# EAGLE design circuit_design_2 (EAGLE 8.6.1)
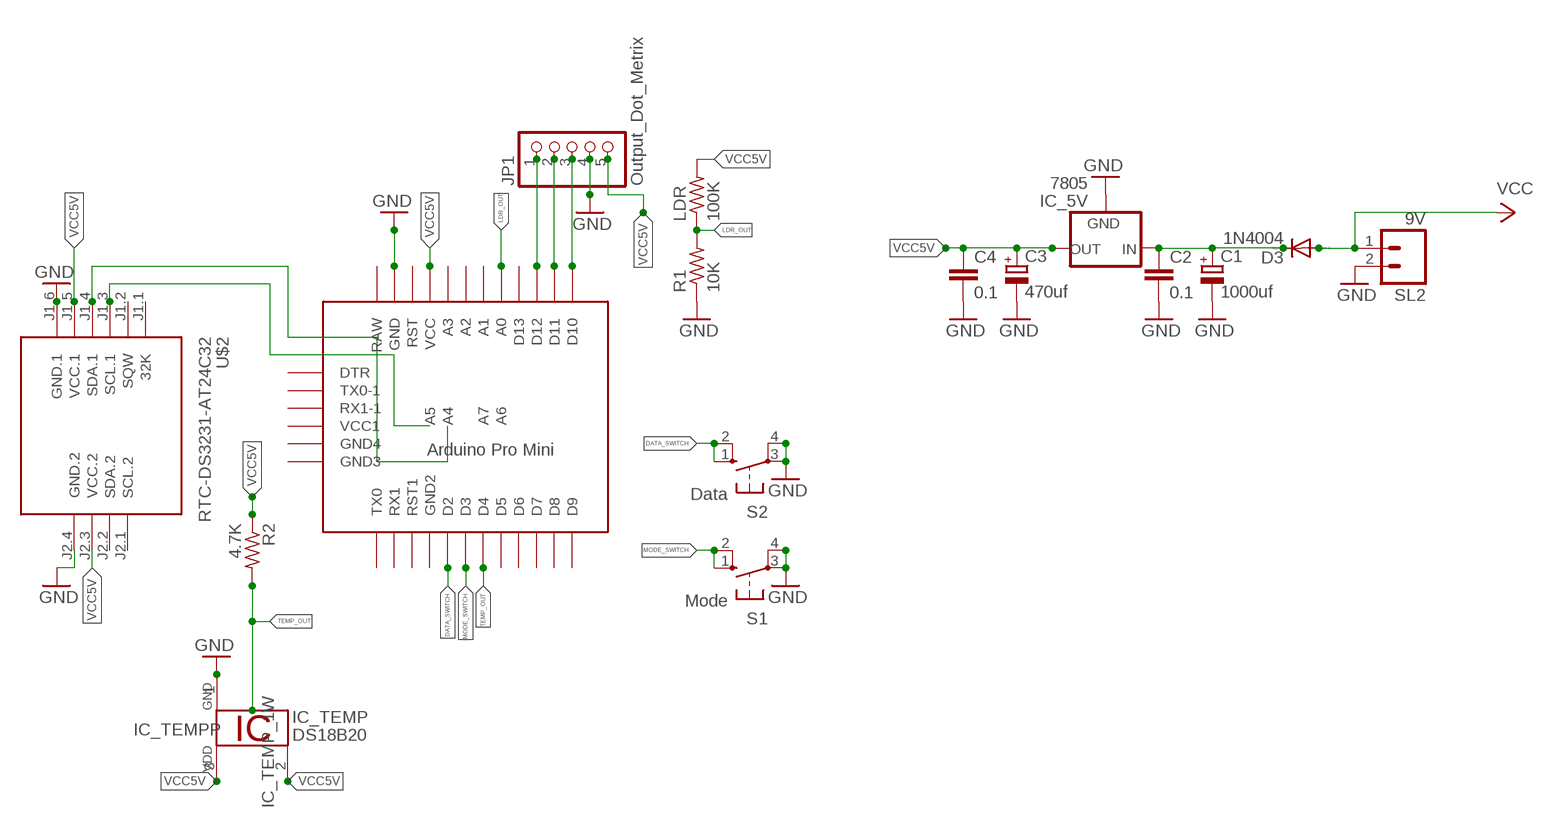
[diagram p0: schematic, sheet 1]

## Parts
C1  1000uf  CPOL-EUE2,5-6E  [E2,5-6E]
C2  0.1  C-EU025-024X044  [C025-024X044]
C3  470uf  CPOL-EUE2,5-6E  [E2,5-6E]
C4  0.1  C-EU025-024X044  [C025-024X044]
D3  1N4004  [DO41-10]
IC_5V  7805  78XXS  [78XXS]
IC_TEMP  DS18B20  [TO92-]
JP1  Output_Dot_Metrix  PINHD-1X5  [1X05]
LDR  100K  R-US_V526-0  [V526-0]
R1  10K  R-US_0309/12  [0309/12]
R2  4.7K  R-US_0309/12  [0309/12]
S1  Mode  10-XX  [B3F-10XX]
S2  Data  10-XX  [B3F-10XX]
SL2  9V  M02  [02P]
U$1  PRO-MINI-2  [PRO-MINI-2]
U$2  RTC-DS3231-AT24C32  [RTC-DS3231-AT24C32]

## Nets
DATA_SWITCH: S2.1(S) S2.2(S1) U$1.D2
GND: C1.- C2.2 C3.- C4.2 IC_5V.GND IC_TEMP.1 JP1.4 R1.1 S1.3(P) S1.4(P1) S2.3(P) S2.4(P1) SL2.2 U$1.GND U$2.J1.6(GND.1) U$2.J2.4(GND.2)
LDR_OUT: LDR.1 R1.2 U$1.A0
MODE_SWITCH: S1.1(S) S1.2(S1) U$1.D3
N$1: C1.+ C2.1 D3.C IC_5V.IN
N$2: U$2.J1.5(VCC.1)
N$3: JP1.5
N$4: U$1.VCC
N$5: IC_TEMP.2
N$6: IC_TEMP.3
N$7: R2.1
N$8: LDR.2
N$9: U$2.J1.4(SDA.1)
N$10: U$2.J1.3(SCL.1)
N$11: JP1.1 U$1.D12
N$12: JP1.2 U$1.D11
N$13: JP1.3 U$1.D10
N$14: U$2.J2.3(VCC.2)
TEMP_OUT: R2.2 U$1.D4
VCC: D3.A SL2.1
VCC5V: C3.+ C4.1 IC_5V.OUT
Unconnected: U$1.A1 U$1.A2 U$1.A3 U$1.A4 U$1.A5 U$1.A6 U$1.A7 U$1.D5 U$1.D6 U$1.D7 U$1.D8 U$1.D9 U$1.D13 U$1.DTR U$1.GND1(GND2) U$1.GND2(GND3) U$1.GND3(GND4) U$1.RAW U$1.RST U$1.RST1 U$1.RX1 U$1.RX1-1 U$1.TX0 U$1.TX0-1 U$1.VCC1 U$2.J1.1(32K) U$2.J1.2(SQW) U$2.J2.1(SCL.2) U$2.J2.2(SDA.2)

## Library data of the parts
C1 C3 = rcl:CPOL-EU: POLARIZED CAPACITOR, European symbol
C2 C4 = rcl:C-EU: CAPACITOR, European symbol
D3 = diode:1N4004: DIODE general purpose rectifier, 1 A
IC_5V = v-reg:78XXS: VOLTAGE REGULATOR
IC_TEMP = 1wire:DS18B20: Programmable Resolution Digital Thermometer This chip provides a onewire thermosensor with approx. 0.5°C accuracy. A programmable over/undertemperure alarm is available. The precision can be set from 9..12 bits. Notes: Vdd must be applied for accurate measurements at low temperatures, as the parasite power circuit otherwise heats the sensor. If parasite power is used, Vdd has to be connected to GND. The DS1822 is a low-cost thermometer chip, the DS18S20 is similar to the DS18B20, but with 9 Bit precision only. Author: Jan Kandziora <jjj@gmx.de>
JP1 = pinhead:PINHD-1X5: PIN HEADER
LDR = rcl:R-US_: RESISTOR, American symbol; SPICEPREFIX: R
R1 R2 = rcl:R-US_: RESISTOR, American symbol
S1 S2 = switch-omron:10-XX: OMRON SWITCH; MPN: B3F-1000; OC_FARNELL: 176432; OC_NEWARK: 36M3542
SL2 = con-amp-quick:M02: AMP QUICK CONNECTOR; OC_FARNELL: unknown; OC_NEWARK: unknown
U$1 = Arduino-clone:PRO-MINI-2: Arduino Pro Mini Layout 2 Sparkfun.com
U$2 = diy-modules:RTC-DS3231-AT24C32: RTC Module with Battery and EEPROM based on DS3231 and AT24C32 chips Tutorial can be found here: https://edwardmallon.wordpress.com/2014/05/21/using-a-cheap-3-ds3231-rtc-at24c32-eeprom-from-ebay/ Click here to find device on ebay.com <http://www.ebay.com/sch/DS3231+AT24C32+module>

## Board
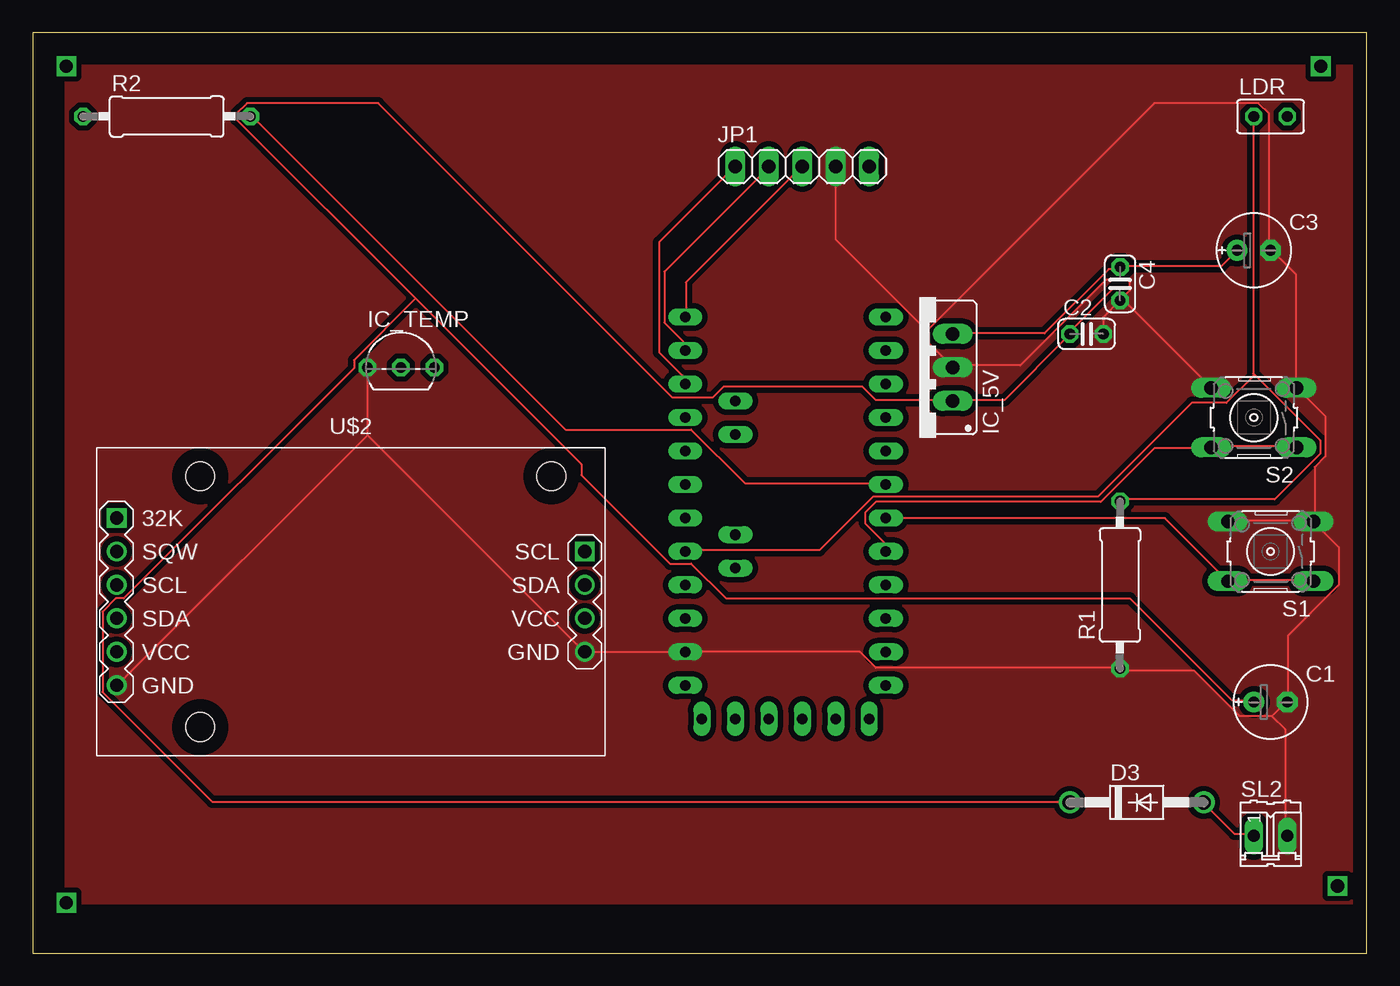
[diagram p1: board, top side]

Size 101.27 x 69.84 mm. Coordinates in mm from the lower left corner, seen from the top.
Outline: 0,0 101.27,0 101.27,69.84 0,69.84 0,0
Copper layers (1*16): Top 0.035mm / dielectric 1.5mm / Bottom 0.035mm
Design rules "default *": minimum track width 6mil, minimum drill 0.35mm, track to track 10mil, track to pad 6mil, pad to pad 6mil, via to via 6mil, smd to smd 6mil, copper to edge 40mil, drill to drill 6mil, minimum pad ring 10mil, minimum via ring 8mil, stop-mask expansion 4mil, vias tented up to drill 0mil, thermal gap 10mil

### Footprints (pad centres in the part's own frame; a part is rotated, then mirrored left to right if it is on the bottom)
E2,5-6E = drill 0.813 pad 1.575: + -1.27,0 | drill 0.813 pad 1.575 octagon: - 1.27,0
C025-024X044 = drill 0.813 octagon: 1 -1.27,0; 2 1.27,0
DO41-10 = drill 1.118: A 5.08,0; C -5.08,0
78XXS = drill 1.016 long: GND 0,-2.54; IN -2.54,-2.54; OUT 2.54,-2.54
TO92- = drill 0.813 octagon: 1 -2.54,0; 2 0,0; 3 2.54,0
1X05 = drill 1.016 long: 1 -5.08,0; 2 -2.54,0; 3 0,0; 4 2.54,0; 5 5.08,0
V526-0 = drill 0.813 octagon: 1 -1.27,0; 2 1.27,0
0309/12 = drill 0.813 octagon: 1 -6.35,0; 2 6.35,0
B3F-10XX = drill 1.016 long: 1 -3.251,2.261; 2 3.251,2.261; 3 -3.251,-2.261; 4 3.251,-2.261
02P = drill 0.914 long: 1 -1.27,0; 2 1.27,0
PRO-MINI-2 = drill 0.8 long: A0 6.35,2.54; A1 6.35,0; A2 6.35,-2.54; A3 6.35,-5.08; A4 2.54,1.27; A5 2.54,3.81; A6 2.54,-8.89; A7 2.54,-6.35; D2 -8.89,2.54; D3 -8.89,0; D4 -8.89,-2.54; D5 -8.89,-5.08; D6 -8.89,-7.62; D7 -8.89,-10.16; D8 -8.89,-12.7; D9 -8.89,-15.24; D10 6.35,-15.24; D11 6.35,-12.7; D12 6.35,-10.16; D13 6.35,-7.62; DTR 5.08,15.24; GND 6.35,10.16; GND1 -8.89,5.08; GND2 -7.62,15.24; GND3 -5.08,15.24; RAW 6.35,12.7; RST 6.35,7.62; RST1 -8.89,7.62; RX1 -8.89,10.16; RX1-1 0,15.24; TX0 -8.89,12.7; TX0-1 2.54,15.24; VCC 6.35,5.08; VCC1 -2.54,15.24
RTC-DS3231-AT24C32 = drill 1 square: J1.1 -17.78,6.35; J2.1 17.78,3.81 | drill 1: J1.2 -17.78,3.81; J1.3 -17.78,1.27; J1.4 -17.78,-1.27; J1.5 -17.78,-3.81; J1.6 -17.78,-6.35; J2.2 17.78,1.27; J2.3 17.78,-1.27; J2.4 17.78,-3.81 | hole 2.2: -11.43,-9.525; -11.43,9.525; 15.24,9.525

### Placement (x,y rotation side)
C1  93.98,19.05 0 top
C2  80.01,46.99 0 top
C3  92.71,53.34 0 top
C4  82.55,50.8 270 top
D3  83.82,11.43 0 top
IC_5V  67.31,44.45 90 top
IC_TEMP  27.94,44.45 0 top
JP1  58.42,59.69 0 top
LDR  93.98,63.5 0 top
R1  82.55,27.94 90 top
R2  10.16,63.5 0 top
S1  93.98,30.48 180 top
S2  92.71,40.64 180 top
SL2  93.98,8.89 0 top
U$1  55.88,33.02 180 top
U$2  24.13,26.67 0 top

### Tracks (layer width: path | path; a pad name or v marks a point on that pad's centre or on a via)
DATA_SWITCH
  Top 0.152: U$1.D2 64.62,30.58 64.62,31.19 63.2,32.61 63.2,33.43 64.01,34.24 81.08,34.24 85.14,38.3 89.41,38.3 S2.2 89.61,38.51 95.91,38.51 S2.1
GND
  Top 0.152: 25.45,44.45 IC_TEMP.1 25.4,39.32 | 41.91,22.96 U$2.J2.4 | U$2.J2.4 U$1.GND 62.79,22.86 64.01,21.64 82.5,21.64 R1.1 82.7,21.44 88.19,21.44 91.64,17.98 94.08,17.98 | 25.4,39.32 41.86,22.86 U$2.J2.4 | 25.4,39.32 6.5,20.42 U$2.J1.6 | C2.2 81.28,48.26 C4.2 82.7,49.68 | 82.7,49.68 89.41,42.98 S2.4 | 82.7,49.68 83.31,50.29 83.31,50.9 83.11,51.11 81.48,51.11 74.98,44.6 69.9,44.6 IC_5V.GND 68.07,46.23 68.07,47.04 67.87,47.24 | JP1.4 60.96,54.15 67.87,47.24 | 94.08,17.98 95.1,19 C1.- 95.3,19.2 95.3,24.08 99.16,27.94 99.16,30.79 97.33,32.61 S1.3 | 94.08,17.98 95.1,16.97 95.1,9.04 SL2.2 | S1.4 90.83,32.82 97.13,32.82 S1.3 | S1.3 97.33,32.82 97.33,36.88 98.15,37.69 98.15,40.74 96.11,42.77 S2.3 95.91,42.98 95.91,51.51 94.08,53.34 C3.- 93.88,53.34 93.88,63.7 93.07,64.52 85.14,64.52 67.87,47.24
  pour Top (isolate 0.406, no thermals): 2.54,67.31 97.79,67.31 100.33,67.31 100.33,3.81 99.06,3.81 2.54,3.81
LDR_OUT
  Top 0.152: 92.66,43.99 92.66,63.5 LDR.1 | 92.66,43.99 92.66,43.79 90.63,41.76 87.99,41.76 80.87,34.65 63.8,34.65 59.74,30.58 49.58,30.58 U$1.A0 | 92.66,43.99 97.74,38.91 97.74,37.9 94.28,34.44 82.7,34.44 R1.2
MODE_SWITCH
  Top 0.152: U$1.D3 85.95,33.02 90.63,28.35 S1.2 90.83,28.35 97.13,28.35 S1.1
N$1
  Top 0.152: 82.91,50.55 82.3,50.55 82.3,50.5 82.09,50.5 78.64,47.04 C2.1 78.64,46.84 73.76,41.96 69.9,41.96 IC_5V.IN 69.7,41.96 64.01,41.96 62.99,42.98 52.43,42.98 51.61,42.16 48.56,42.16 26.21,64.52 16.26,64.52 15.44,63.7 15.44,63.3 29.06,49.68 | 29.06,49.68 41.66,37.08 41.66,36.27 48.36,29.57 49.99,29.57 52.63,26.92 83.31,26.92 91.03,19.2 92.66,19.2 C1.+ | 29.06,49.68 24.38,45.01 24.38,44.4 6.91,26.92 6.3,26.92 5.28,25.91 5.28,19.81 13.61,11.48 78.64,11.48 D3.C
N$11
  Top 0.152: U$1.D12 49.38,43.18 49.38,43.79 47.55,45.62 47.55,53.95 53.24,59.64 JP1.1
N$12
  Top 0.152: U$1.D11 49.38,45.82 49.38,46.43 47.95,47.85 47.95,51.71 55.88,59.64 JP1.2
N$13
  Top 0.152: U$1.D10 49.58,48.26 49.58,50.9 58.32,59.64 JP1.3
N$15  (via drill 1 pad 1.3)
  other vias: 2.54,67.31
N$16  (via drill 1 pad 1.3)
  other vias: 97.79,67.31
N$17  (via drill 1 pad 1.3)
  other vias: 99.06,5.08
N$18  (via drill 1 pad 1.3)
  other vias: 2.54,3.81
TEMP_OUT
  Top 0.152: U$1.D4 64.62,35.66 54.05,35.66 49.99,39.73 40.44,39.73 16.66,63.5 R2.2
VCC
  Top 0.152: 92.66,8.94 SL2.1 92.66,9.04 91.24,9.04 89,11.28 D3.A
VCC5V
  Top 0.152: 69.95,47.04 IC_5V.OUT 69.9,47.04 76.81,47.04 81.69,51.92 82.5,51.92 C4.1 | 82.45,52.07 C4.1 | C3.+ 90.22,52.12 82.7,52.12 C4.1